# EAGLE design telemtryWing (EAGLE 6.6.0)
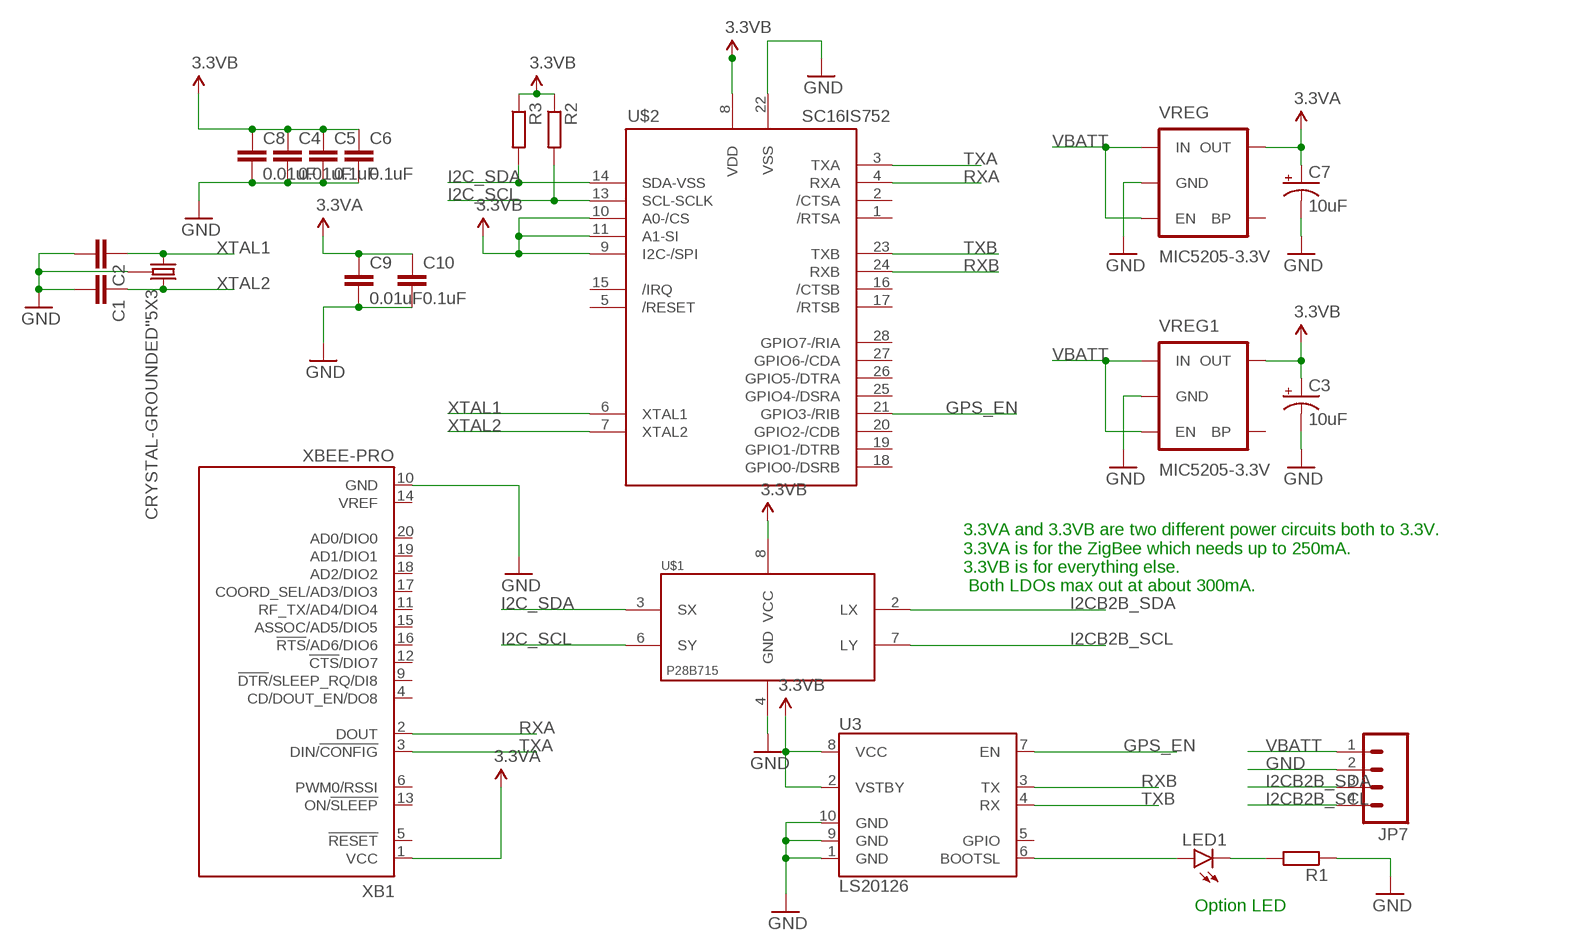
[diagram p0: schematic, sheet 1]

## Parts
C1  C0603  [C0603]
C2  C0603  [C0603]
C3  10uF  CAP_POL1206  [EIA3216]
C4  0.01uF  C0603  [C0603]
C5  0.1uF  C0603  [C0603]
C6  0.1uF  C0603  [C0603]
C7  10uF  CAP_POL1206  [EIA3216]
C8  0.01uF  C0603  [C0603]
C9  0.01uF  C0603  [C0603]
C10  0.1uF  C0603  [C0603]
JP7  M04JST  [1X04-1.5MM_JST]
LED1  LED0603  [LED-0603]
R1  R0603  [R0603]
R2  R0603  [R0603]
R3  R0603  [R0603]
U3  LS20126  [LS20126]
U$1  P82B715  [SO8]
U$2  SC16IS752  [TSSOP28]
U$3  CRYSTAL-GROUNDED''5X3  [CRYSTAL-SMD-5X3]
VREG  MIC5205-3.3V  V_REG_LDOSMD  [SOT23-5]
VREG1  MIC5205-3.3V  V_REG_LDOSMD  [SOT23-5]
XB1  XBEE-PRO  [XBEE-PRO]

## Nets
3.3V: C3.A(+) C4.1 C5.1 C6.1 C8.1 R2.1 R3.1 U3.2(VSTBY) U3.8(VCC) U$1.8(VCC) U$2.8(VDD) U$2.9(I2C-/SPI) U$2.10(A0-/CS) U$2.11(A1-SI) VREG1.5(OUT) ; supply symbol labelled 3.3VB
GND: C1.2 C2.2 C3.C(-) C4.2 C5.2 C6.2 C7.C(-) C8.2 C9.2 C10.2 JP7.2 R1.1 U3.1(GND) U3.9(GND) U3.10(GND) U$1.4(GND) U$2.22(VSS) U$3.2 U$3.4 VREG1.2(GND) VREG.2(GND) XB1.10(GND)
GPS_EN: U3.7(EN) U$2.21(GPIO3-/RIB)
I2C_SCL: R2.2 U$1.6(SY) U$2.13(SCL-SCLK)
I2C_SDA: R3.2 U$1.3(SX) U$2.14(SDA-VSS)
I2CB2B_SCL: JP7.4 U$1.7(LY)
I2CB2B_SDA: JP7.3 U$1.2(LX)
N$1: LED1.C R1.2
N$3: LED1.A U3.6(BOOTSL)
RXA: U$2.4(RXA) XB1.2(DOUT)
RXB: U3.3(TX) U$2.24(RXB)
TXA: U$2.3(TXA) XB1.3(DIN/!CONFIG)
TXB: U3.4(RX) U$2.23(TXB)
VBATT: JP7.1 VREG1.1(IN) VREG1.3(EN) VREG.1(IN) VREG.3(EN)
VCC: C7.A(+) C9.1 C10.1 VREG.5(OUT) XB1.1(VCC) ; supply symbol labelled 3.3VA
XTAL1: C2.1 U$2.6(XTAL1) U$3.3
XTAL2: C1.1 U$2.7(XTAL2) U$3.1
Unconnected: U3.5(GPIO) U$2.1(/RTSA) U$2.2(/CTSA) U$2.5(/RESET) U$2.15(/IRQ) U$2.16(/CTSB) U$2.17(/RTSB) U$2.18(GPIO0-/DSRB) U$2.19(GPIO1-/DTRB) U$2.20(GPIO2-/CDB) U$2.25(GPIO4-/DSRA) U$2.26(GPIO5-/DTRA) U$2.27(GPIO6-/CDA) U$2.28(GPIO7-/RIA) VREG1.4(BP) VREG.4(BP) XB1.4(CD/DOUT_EN/DO8) XB1.5(!RESET) XB1.6(PWM0/RSSI) XB1.9(!DTR!/SLEEP_RQ/DI8) XB1.11(RF_TX/AD4/DIO4) XB1.12(!CTS!/DIO7) XB1.13(ON/!SLEEP) XB1.14(VREF) XB1.15(ASSOC/AD5/DIO5) XB1.16(!RTS!/AD6/DIO6) XB1.17(COORD_SEL/AD3/DIO3) XB1.18(AD2/DIO2) XB1.19(AD1/DIO1) XB1.20(AD0/DIO0)

## Notes on the sheet
- 3.3VA and 3.3VB are two different power circuits both to 3.3V. 
  3.3VA is for the ZigBee which needs up to 250mA. 
  3.3VB is for everything else.
   Both LDOs max out at about 300mA.
- Option LED

## Library data of the parts
C1 C2 C4-C6 C8-C10 = ELL-i-Passives:C: Surface Mount Capasitors — in standard sizes A capacitor used to store energy electrostatically in an electric field. If you need a high-value capacitor, consider using a polarised capacitor to save space. Wikipedia article on capacitors <https://en.wikipedia.org/wiki/Capacitor>
C3 C7 = SparkFun-Capacitors:CAP_POL: Capacitor Polarized These are standard SMD and PTH capacitors. Normally 10uF, 47uF, and 100uF in electrolytic and tantalum varieties. Always verify the external diameter of the through hole cap, it varies with capacity, voltage, and manufacturer. The EIA devices should be standard.
JP7 = SparkFun-Connectors:M04: Header 4 Standard 4-pin 0.1" header. Use with straight break away headers (SKU : PRT-00116), right angle break away headers (PRT-00553), swiss pins (PRT-00743), machine pins (PRT-00117), and female headers (PRT-00115). Molex polarized connector foot print use with SKU : PRT-08231 with associated crimp pins and housings. 1MM SMD Version SKU: PRT-10208; OC_NEWARK: unknown
LED1 = SparkFun-LED:LED: LEDs Standard schematic elements and footprints for 5mm, 3mm, 1206, and 0603 sized LEDs. 5mm - Spark Fun Electronics SKU : COM-00529 (and others)
R1-R3 = ELL-i-Passives:R: Surface Mount Resistor — in standard sizes
U3 = SparkFun-RF:LS20126: LS20126 20-Channel GPS Module SparkFun SKU# GPS-09838 The LOCOSYS LS20126 GPS smart antenna module is a high sensitivity, low power, SMD type, 20 channels with built-in magnetic sensor, 3-axial acceleration sensor L1 GPS receiver and 10mm patch antenna designed for portable applications.
U$1 = Sensors:P82B715
U$2 = SparkFun-DigitalIC:SC16IS752
U$3 = SparkFun-FreqCtrl:CRYSTAL-GROUNDED
VREG VREG1 = SparkFun:V_REG_LDO: Voltage Regulator LDO Standard 150mA LDO voltage regulator in SOT-23 layout. Micrel part MIC5205. BP (by-pass) pin is used to lower output noise with 470pF cap.
XB1 = maxstream:XBEE: XBee (TM) /XBee-PRO(TM) OEM RF Modules Source: MaxStream, Inc. xbee_productmanual.pdf; MPN: XBP24-AWI-001; OC_FARNELL: 1337916; OC_NEWARK: 42M2667

## Board
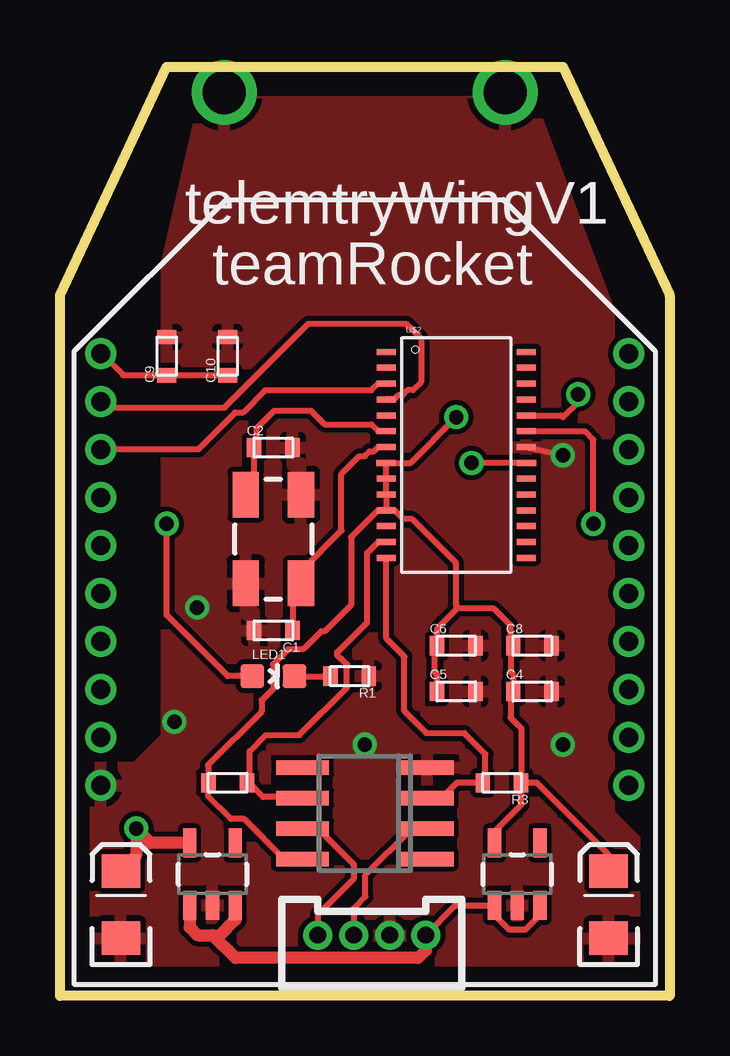
[diagram p1: board, top side]
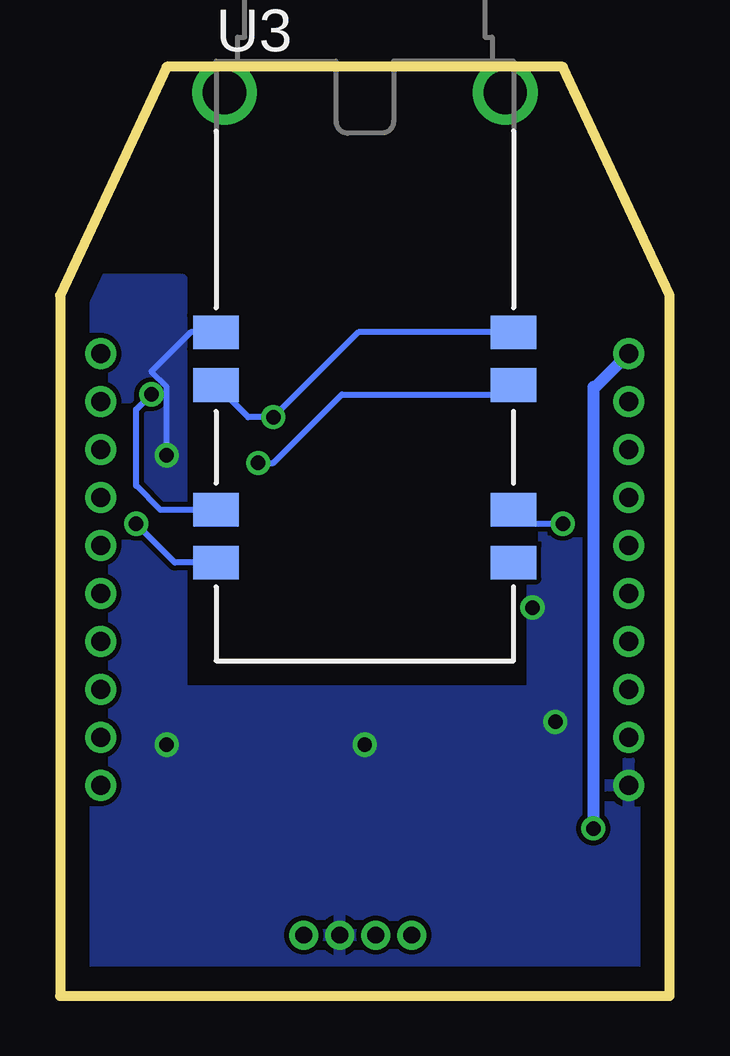
[diagram p2: board, bottom side, seen from below]

Size 25.4 x 38.73 mm. Coordinates in mm from the lower left corner, seen from the top.
Outline: 0,0 0,29.21 4.45,38.73 20.95,38.73 25.4,29.21 25.4,0 0,0
Copper layers (1*16): Top 0.035mm / dielectric 1.5mm / Bottom 0.035mm
Design rules "default": minimum track width 10mil, minimum drill 24mil, track to track 8mil, track to pad 8mil, pad to pad 8mil, via to via 8mil, smd to smd 8mil, copper to edge 40mil, drill to drill 8mil, minimum pad ring 10mil, minimum via ring 8mil, stop-mask expansion 4mil, vias tented up to drill 0mil, thermal gap 10mil

### Footprints (pad centres in the part's own frame; a part is rotated, then mirrored left to right if it is on the bottom)
C0603 = smd 0.6 x 0.8: 1 -0.8,0; 2 0.8,0
EIA3216 = smd 1.4 x 1.6: A 1.4,0; C -1.4,0
1X04-1.5MM_JST = drill 0.7: 1 0,0; 2 1.5,0; 3 3,0; 4 4.5,0
LED-0603 = smd 1 x 1: A 0,-0.877; C 0,0.877
R0603 = smd 0.6 x 0.8: 1 -0.8,0; 2 0.8,0
LS20126 = smd 1.9 x 1.4: 1 -6.2,13.7; 2 -6.2,11.5; 3 -6.2,6.3; 4 -6.2,4.1; 5 6.2,4.1; 6 6.2,6.3; 7 6.2,11.5; 8 6.2,13.7 | drill 1.8: 9 5.85,23.7; 10 -5.85,23.7
SO8 = smd 0.6 x 2.2: 1 -1.905,-2.6; 2 -0.635,-2.6; 3 0.635,-2.6; 4 1.905,-2.6; 5 1.905,2.6; 6 0.635,2.6; 7 -0.635,2.6; 8 -1.905,2.6
TSSOP28 = smd 0.8 x 0.25: 1 -2.921,4.623; 2 -2.921,3.962; 3 -2.921,3.302; 4 -2.921,2.642; 5 -2.921,1.981; 6 -2.921,1.321; 7 -2.921,0.66; 8 -2.927,0; 9 -2.921,-0.66; 10 -2.921,-1.321; 11 -2.921,-1.981; 12 -2.921,-2.642; 13 -2.921,-3.302; 14 -2.921,-3.962; 15 2.921,-3.962; 16 2.921,-3.302; 17 2.921,-2.642; 18 2.921,-1.981; 19 2.921,-1.321; 20 2.921,-0.66; 21 2.927,0; 22 2.921,0.66; 23 2.921,1.321; 24 2.921,1.981; 25 2.921,2.642; 26 2.921,3.302; 27 2.921,3.962; 28 2.921,4.623
CRYSTAL-SMD-5X3 = smd 1.9 x 1.1: 1 -1.85,-1.15; 2 1.85,-1.15; 3 1.85,1.15; 4 -1.85,1.15
SOT23-5 = smd 0.55 x 1.2: 1 -0.95,-1.3; 2 0,-1.3; 3 0.95,-1.3; 4 0.95,1.3; 5 -0.95,1.3
XBEE-PRO = drill 0.8 pad 1.27: 1 -11,9; 2 -11,7; 3 -11,5; 4 -11,3; 5 -11,1; 6 -11,-1; 7 -11,-3; 8 -11,-5; 9 -11,-7; 10 -11,-9; 11 11,-9; 12 11,-7; 13 11,-5; 14 11,-3; 15 11,-1; 16 11,1; 17 11,3; 18 11,5; 19 11,7; 20 11,9

### Placement (x,y rotation side)
C1  8.89,15.24 180 top
C2  8.89,22.86 0 top
C3  22.86,3.81 90 top
C4  19.68,12.7 0 top
C5  16.51,12.7 0 top
C6  16.51,14.61 0 top
C7  2.54,3.81 90 top
C8  19.68,14.61 0 top
C9  4.45,26.67 90 top
C10  6.99,26.67 90 top
JP7  15.24,2.54 180 top
LED1  8.89,13.34 270 top
R1  12.06,13.34 180 top
R2  6.99,8.89 0 top
R3  18.41,8.89 180 top
U3  12.7,13.97 0 bottom
U$1  12.7,7.62 90 top
U$2  16.51,22.23 0 top
U$3  8.89,19.05 90 top
VREG  6.35,5.08 0 top
VREG1  19.05,5.08 0 top
XB1  12.7,17.78 0 top

### Tracks (layer width: path | path; a pad name or v marks a point on that pad's centre or on a via)
3.3V  (via drill 0.6)
  Top 0.254: VREG1.5 18.1,6.85 19.23,7.97 19.23,8.88 R3.1 | C3.A 22.85,5.22 22.85,5.9 19.85,8.9 19.35,8.9 R3.1 | U$1.8 10.07,5.72 9.32,5.72 7.67,7.38 7.12,7.38 6.17,8.32 6.17,8.88 R2.1 6.17,9 6.17,9.62 8.4,11.85 8.4,12.32 8.88,12.8 8.88,13.82 9.5,14.45 10.12,14.45 10.88,15.2 11.03,15.2 12.12,16.3 12.12,19.12 13.25,20.25 13.47,20.25 U$2.11 | U$2.11 U$2.10 13.6,21.02 U$2.9 13.6,21.68 13.6,22.2 U$2.8 14.61,22.23 v16.51,24.13 | C5.1 15.7,12.72 15.7,13.4 15.6,13.5 15.6,14.4 15.7,14.5 C6.1 15.7,14.72 15.7,15.3 16.55,16.15 | 16.55,16.15 18.07,16.15 18.77,15.45 18.77,14.68 C8.1 18.88,14.5 18.77,14.4 18.77,13.5 18.88,13.4 18.88,12.72 C4.1 18.77,12.65 18.77,11.6 19.23,11.15 19.23,9 R3.1 | U$2.11 13.72,20.25 13.93,20.25 14.3,19.88 14.68,19.88 16.5,18.05 16.5,16.27 16.55,16.15
  Bottom 0.254: U3.2 17.56,24.13 v16.51,24.13 12.97,27.67 U3.8
GND  (via drill 0.6)
  Top 0.254: U$2.22 v20.95,22.54
  Bottom 0.254: U3.1 19.95,27.67 21.59,26.04 20.95,25.4 v20.95,22.54
  other vias: 20.95,10.48 4.76,11.43 4.76,11.43 5.71,16.19 12.7,10.48
  pour Top: 1.27,9.53 3.17,9.53 4.45,10.79 4.45,30.48 6.35,38.73 19.05,38.73 22.86,28.57 22.86,7.62 24.13,6.35 24.13,1.27 24.77,0.64 1.91,0.64 1.27,1.27
  pour Bottom: 0,29.21 5.71,29.21 5.71,12.7 20.32,12.7 20.32,29.84 24.77,29.84 24.77,0 0,0 0,28.57
GPS_EN  (via drill 0.6)
  Top 0.254: U$2.21 v17.14,22.23
  Bottom 0.254: v17.14,22.23 16.51,22.23 13.65,25.08 6.89,25.08 U3.7
I2C_SCL
  Top 0.254: U$1.6 10.07,8.25 9.97,8.25 9.93,8.3 8.45,8.3 7.88,8.88 7.8,8.88 R2.2 7.9,9 7.9,10.2 8.57,10.88 9.97,10.88 11.95,12.85 11.95,13.82 11.7,14.07 11.68,14.07 11.55,14.2 11.55,14.32 12.8,15.57 12.8,18.48 13.25,18.93 13.57,18.93 U$2.13
I2C_SDA
  Top 0.254: U$1.3 15.32,8.25 15.9,8.25 16.55,8.9 R3.2 17.73,8.95 17.73,10.07 16.85,10.95 15.28,10.95 14.35,11.88 14.35,14.15 13.6,14.9 U$2.14
I2CB2B_SCL
  Top 0.254: U$1.7 10.12,6.97 10.75,6.97 12.25,5.47 12.25,4.9 10.75,3.4 JP7.4
I2CB2B_SDA
  Top 0.254: U$1.2 15.28,6.97 14.65,6.97 12.72,5.05 12.72,4.15 12.25,3.67 JP7.3
N$1
  Top 0.254: R1.2 11.25,13.32 9.78,13.32 LED1.C
N$3  (via drill 0.6)
  Top 0.254: LED1.A 6.99,13.34 4.45,15.88 v4.45,19.68
  Bottom 0.254: v4.45,19.68 5.92,19.68 U3.6
RXA
  Top 0.254: U$2.4 13.93,24.88 14.1,25.05 14.28,25.05 14.47,25.25 14.7,25.25 15.05,25.6 15.05,27.4 14.43,28.02 10.35,28.02 6.85,24.52 1.98,24.52 1.73,24.77 XB1.2
RXB  (via drill 0.6)
  Top 0.254: v21.59,25.08 21.59,24.77 20.95,24.13 20.88,24.21 U$2.24
  Bottom 0.254: U3.3 21.22,20.27 22.23,21.27 22.23,24.45 v21.59,25.08
TXA
  Top 0.254: U$2.3 13.57,25.52 13.25,25.52 12.97,25.25 8.55,25.25 7.62,24.32 7.3,24.32 5.78,22.8 1.73,22.8 XB1.3
TXB  (via drill 0.6)
  Top 0.254: v22.23,19.68 22.23,23.18 21.86,23.55 U$2.23
  Bottom 0.254: U3.4 20.61,18.07 v22.23,19.68
VBATT
  Top 0.254: JP7.1 16.48,3.77 18.07,3.77 VREG1.1 18.1,3.38 18.7,2.77 19.4,2.77 20,3.38 VREG1.3
  Top 0.508: JP7.1 15.24,1.91 14.92,1.59 7.3,1.59 6.35,2.54 | 6.35,2.54 6.67,2.54 7.3,3.17 VREG.3 | VREG.1 5.4,2.85 5.71,2.54 6.35,2.54
VCC  (via drill 0.6)
  Top 0.254: XB1.1 1.73,26.77 2.62,25.88 4.42,25.88 C9.1 4.58,25.88 6.97,25.88 C10.1
  Top 0.508: C7.A 3.17,5.84 v3.17,6.99 3.78,6.38 VREG.5
  Bottom 0.508: v3.17,6.99 3.17,25.4 3.08,25.4 XB1.1
XTAL1
  Top 0.254: U$3.3 7.75,20.93 7.75,21 8.1,21.35 C2.1 8.2,22.93 8.2,23.68 8.93,24.4 10.45,24.4 11.03,23.82 12.97,23.82 13.25,23.55 13.57,23.55 U$2.6
XTAL2
  Top 0.254: C1.1 9.7,16.73 10.05,17.07 10.05,17.18 U$3.1 10.05,17.32 10.05,17.73 11.72,19.4 11.72,21.75 12.47,22.5 12.7,22.5 12.9,22.7 13.07,22.7 13.25,22.88 13.57,22.88 U$2.7

### Text on the board
tNames: telemtryWingV1 | teamRocket